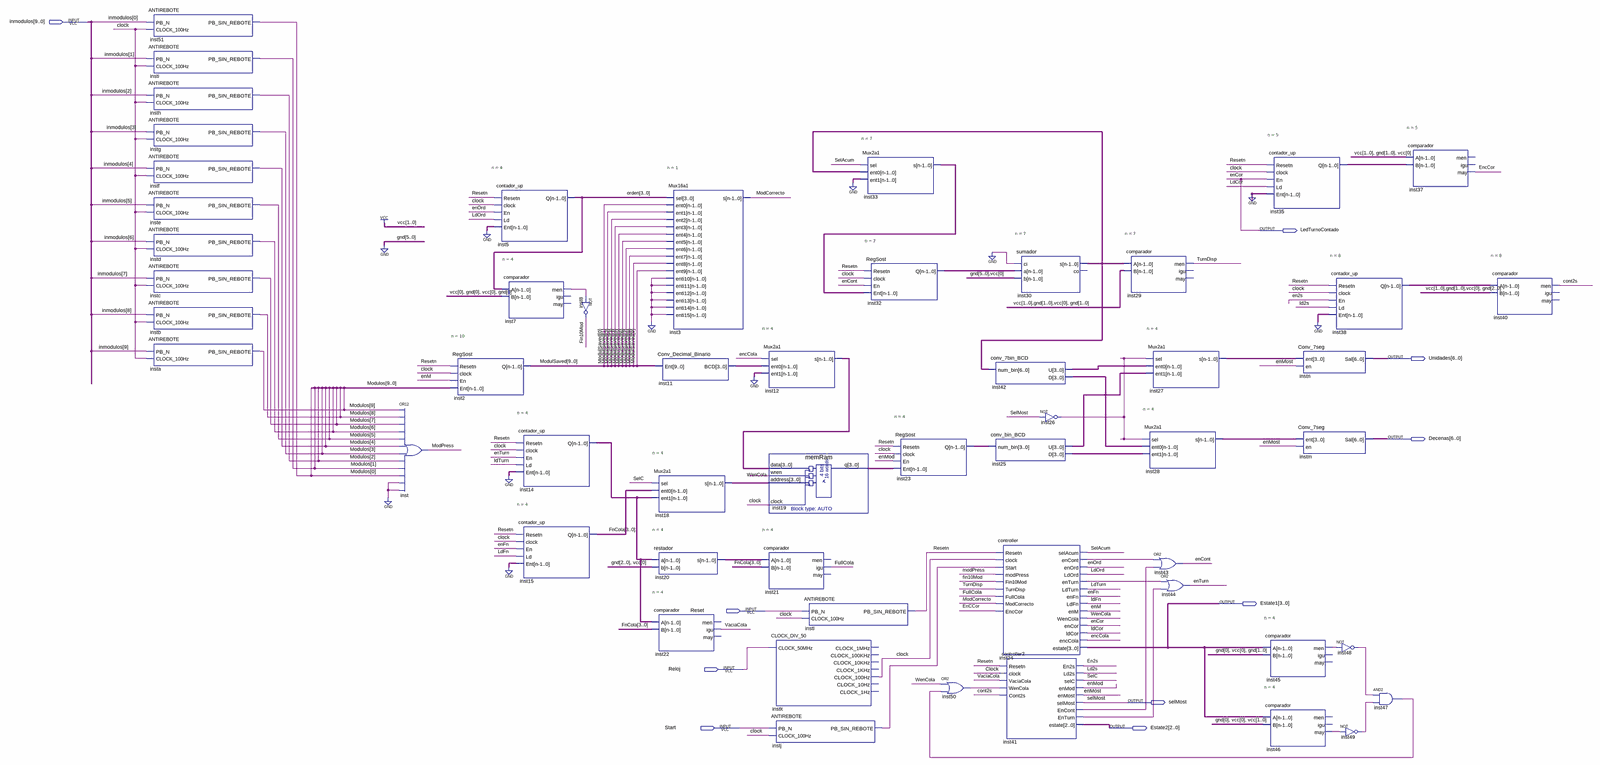
[diagram p0: schematic sheet, whole]
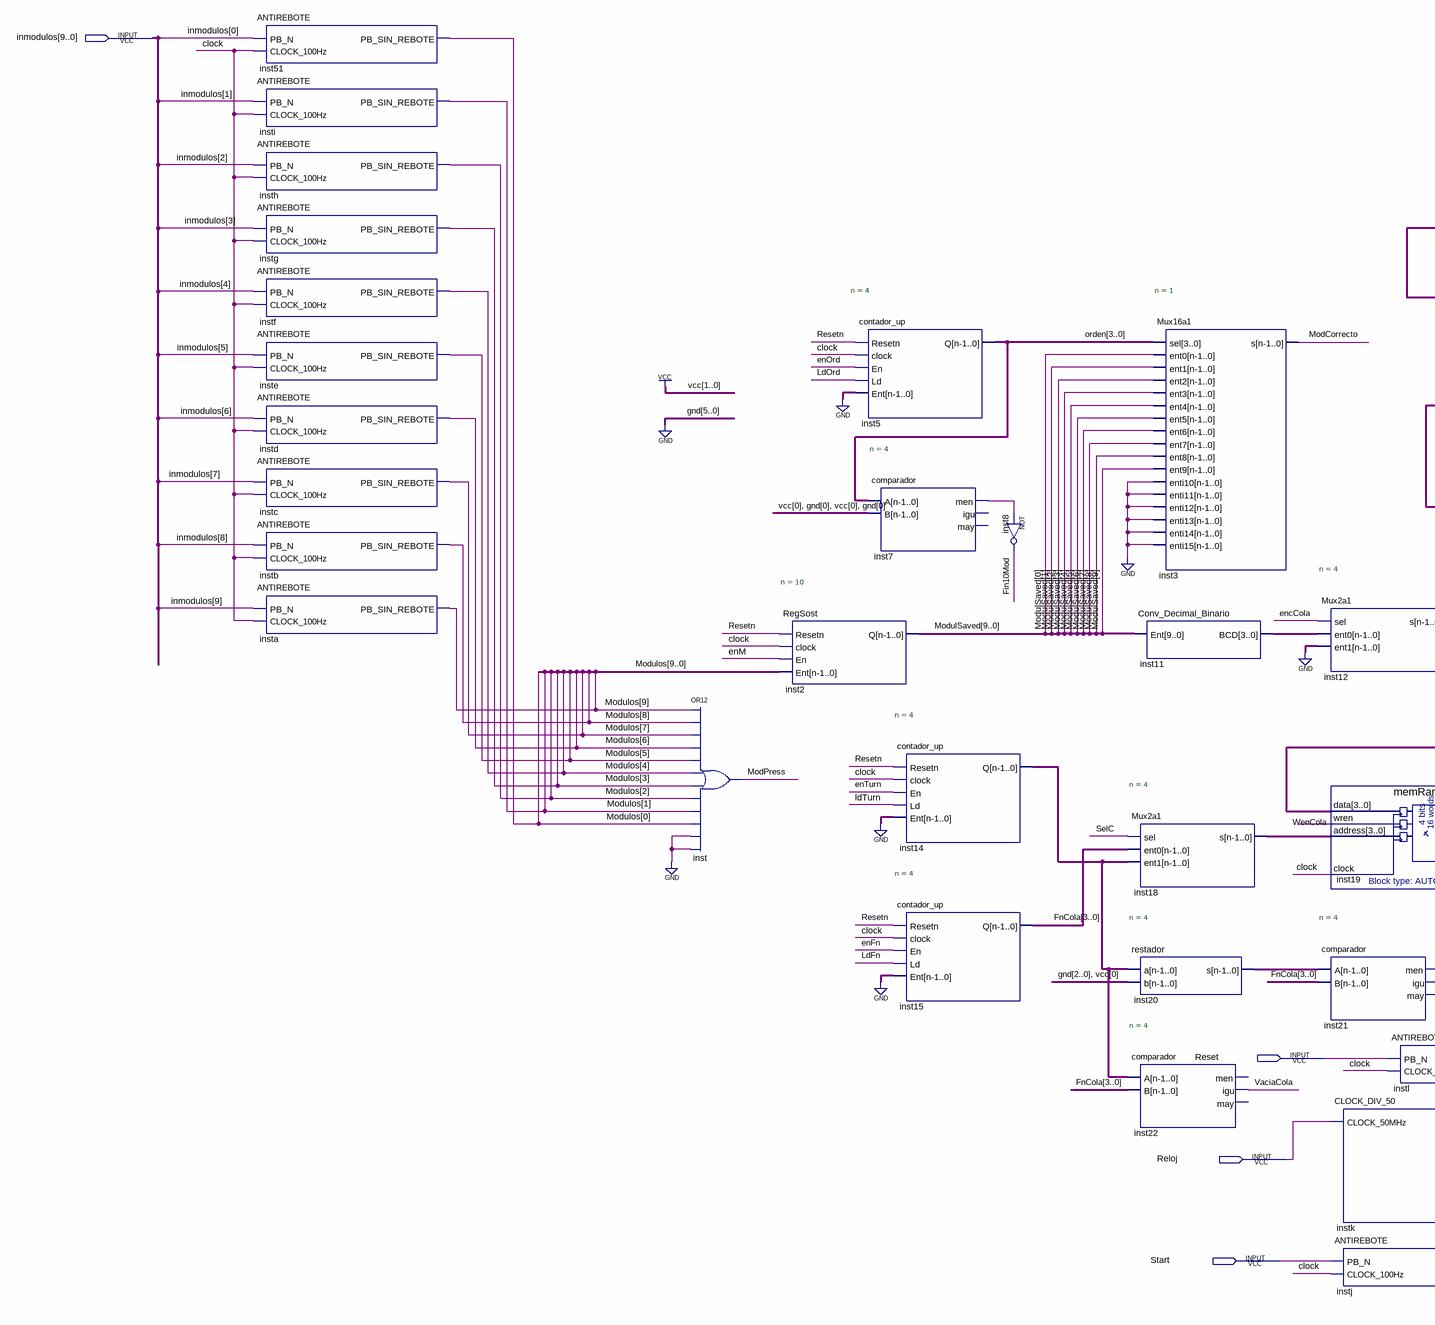
[diagram p1: schematic sheet, left part]
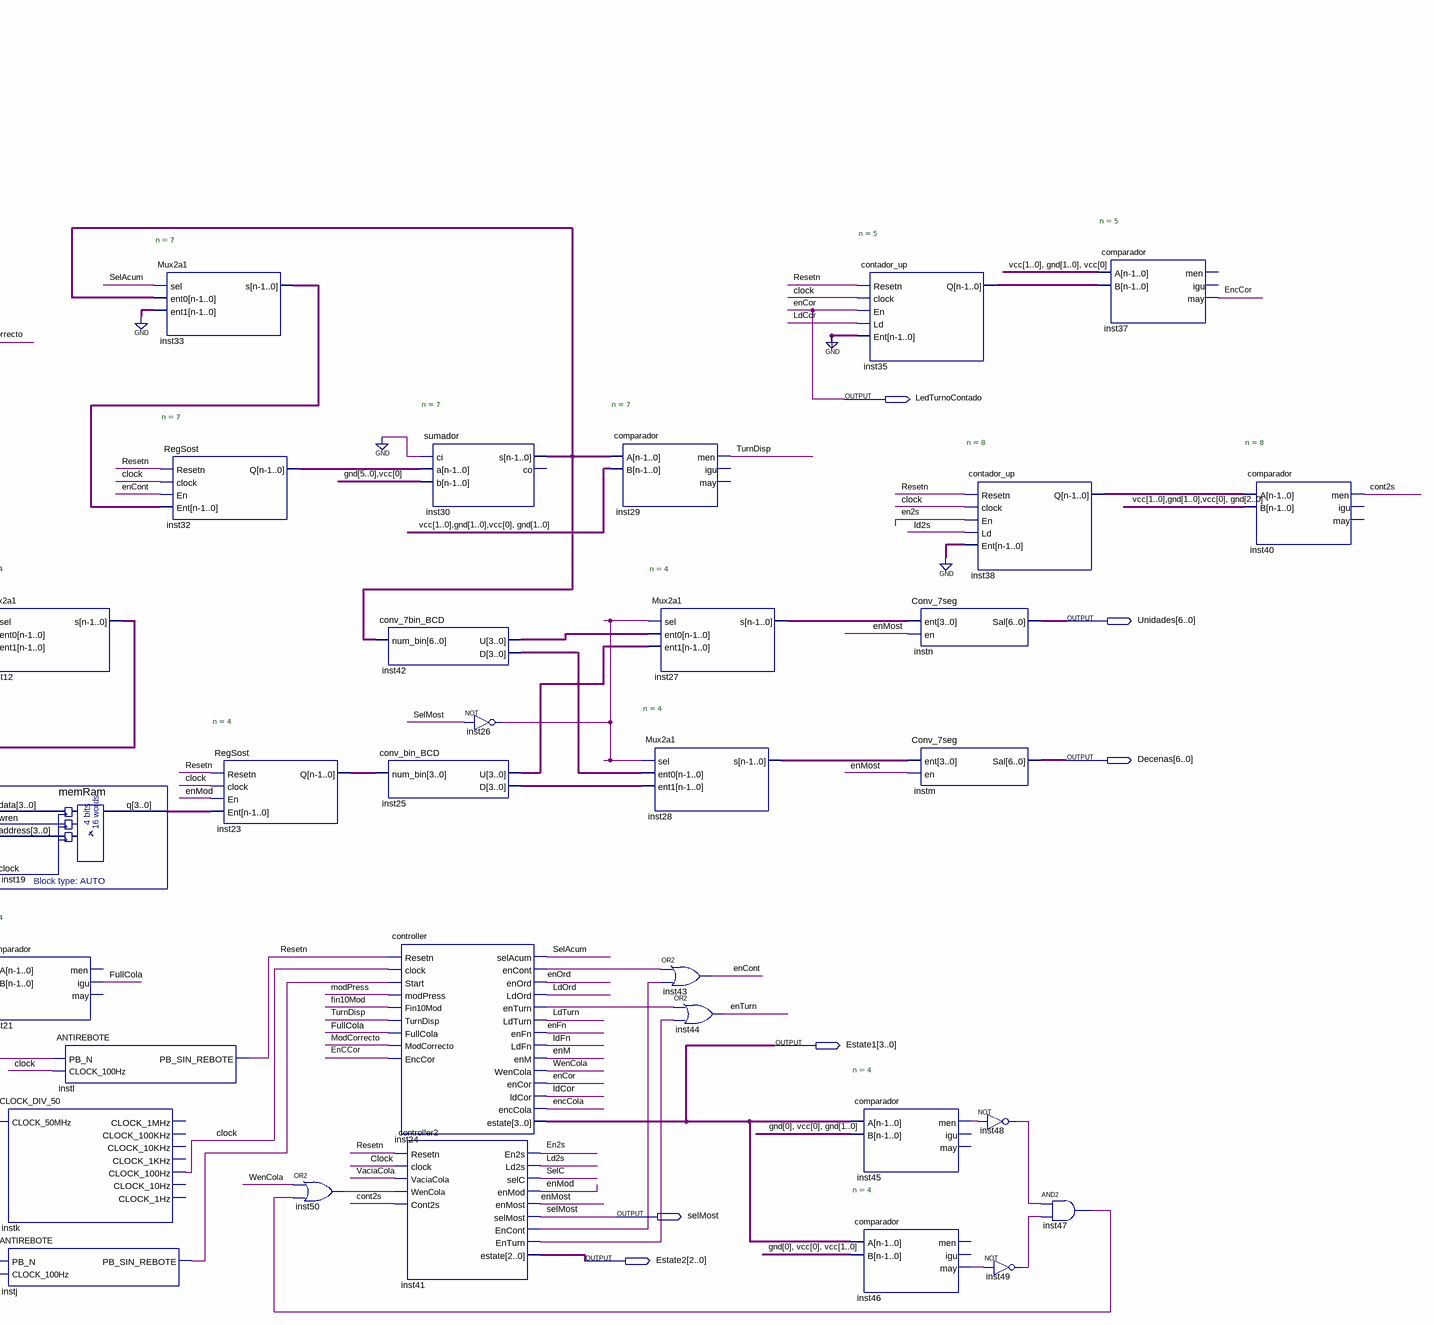
[diagram p2: schematic sheet, right part]
// Quartus schematic turno.bdf as structural Verilog: 54 symbols, 10 pins
module turno (
  input  [9:0] inmodulos,
  input  Reset,
  input  Reloj,
  input  Start,
  output LedTurnoContado,
  output [6:0] Unidades,
  output [6:0] Decenas,
  output [3:0] Estate1,
  output selMost,
  output [2:0] Estate2
);

  wire clock, cont2s, en2s, encCola, EncCor, enCont, enFn, enM, enMod, enMost, enOrd, enTurn, Fin10Mod,
       FullCola, inst7_men, inst24_encont, inst24_enturn, inst26_out, inst41_encont, inst41_enturn,
       inst45_men, inst46_may, inst47_out, inst48_out, inst49_out, inst50_out, instj_pb_sin_rebote, ld2s,
       LdCor, LdFn, LdOrd, ldTurn, ModCorrecto, ModPress, Resetn, SelAcum, SelC, TurnDisp, VaciaCola, WenCola;
  wire [3:0] FnCola, inst11_bcd, inst12_s, inst14_q, inst18_s, inst19_q, inst20_s, inst23_q, inst25_d,
       inst25_u, inst27_s, inst28_s, inst42_d, inst42_u, orden;
  wire [4:0] inst35_q;
  wire [6:0] inst30_s, inst32_q, inst33_s;
  wire [7:0] inst38_q;
  wire [9:0] Modulos, ModulSaved;

  ANTIREBOTE inst51 (.PB_N(inmodulos[0]), .CLOCK_100Hz(clock), .PB_SIN_REBOTE(Modulos[0]));
  ANTIREBOTE insti (.PB_N(inmodulos[1]), .CLOCK_100Hz(clock), .PB_SIN_REBOTE(Modulos[1]));
  ANTIREBOTE insth (.PB_N(inmodulos[2]), .CLOCK_100Hz(clock), .PB_SIN_REBOTE(Modulos[2]));
  ANTIREBOTE instg (.PB_N(inmodulos[3]), .CLOCK_100Hz(clock), .PB_SIN_REBOTE(Modulos[3]));
  ANTIREBOTE instf (.PB_N(inmodulos[4]), .CLOCK_100Hz(clock), .PB_SIN_REBOTE(Modulos[4]));
  ANTIREBOTE inste (.PB_N(inmodulos[5]), .CLOCK_100Hz(clock), .PB_SIN_REBOTE(Modulos[5]));
  ANTIREBOTE instd (.PB_N(inmodulos[6]), .CLOCK_100Hz(clock), .PB_SIN_REBOTE(Modulos[6]));
  ANTIREBOTE instc (.PB_N(inmodulos[7]), .CLOCK_100Hz(clock), .PB_SIN_REBOTE(Modulos[7]));
  ANTIREBOTE instb (.PB_N(inmodulos[8]), .CLOCK_100Hz(clock), .PB_SIN_REBOTE(Modulos[8]));
  ANTIREBOTE insta (.PB_N(inmodulos[9]), .CLOCK_100Hz(clock), .PB_SIN_REBOTE(Modulos[9]));
  or inst (ModPress, Modulos[9], Modulos[8], Modulos[7], Modulos[6], Modulos[5], Modulos[4], Modulos[3], Modulos[2], Modulos[1], Modulos[0], 1'b0, 1'b0);
  RegSost #(.n(10)) inst2 (.Resetn(Resetn), .clock(clock), .En(enM), .Ent(Modulos), .Q(ModulSaved));
  contador_up #(.n(4)) inst5 (.Resetn(Resetn), .clock(clock), .En(enOrd), .Ld(LdOrd), .Ent(4'b0000), .Q(orden));
  comparador #(.n(4)) inst7 (.A(orden), .B(4'b1010), .men(inst7_men));  // open: igu, may
  contador_up #(.n(4)) inst14 (.Resetn(Resetn), .clock(clock), .En(enTurn), .Ld(ldTurn), .Ent(4'b0000), .Q(inst14_q));
  contador_up #(.n(4)) inst15 (.Resetn(Resetn), .clock(clock), .En(enFn), .Ld(LdFn), .Ent(4'b0000), .Q(FnCola));
  not inst8 (Fin10Mod, inst7_men);
  Mux16a1 #(.n(1)) inst3 (
    .sel(orden), .ent0(ModulSaved[0]), .ent1(ModulSaved[1]), .ent2(ModulSaved[2]), .ent3(ModulSaved[3]),
    .ent4(ModulSaved[4]), .ent5(ModulSaved[5]), .ent6(ModulSaved[6]), .ent7(ModulSaved[7]),
    .ent8(ModulSaved[8]), .ent9(ModulSaved[9]), .enti10(1'b0), .enti11(1'b0), .enti12(1'b0), .enti13(1'b0),
    .enti14(1'b0), .enti15(1'b0), .s(ModCorrecto));
  Conv_Decimal_Binario inst11 (.Ent(ModulSaved), .BCD(inst11_bcd));
  Mux2a1 #(.n(4)) inst18 (.sel(SelC), .ent0(FnCola), .ent1(inst14_q), .s(inst18_s));
  restador #(.n(4)) inst20 (.a(inst14_q), .b(4'b0001), .s(inst20_s));
  comparador #(.n(4)) inst22 (.A(inst14_q), .B(FnCola), .igu(VaciaCola));  // open: men, may
  Mux2a1 #(.n(4)) inst12 (.sel(encCola), .ent0(inst11_bcd), .ent1(4'b0000), .s(inst12_s));
  comparador #(.n(4)) inst21 (.A(inst20_s), .B(FnCola), .igu(FullCola));  // open: men, may
  memRam inst19 (.data(inst12_s), .wren(WenCola), .address(inst18_s), .clock(clock), .q(inst19_q));
  CLOCK_DIV_50 instk (
    .CLOCK_50MHz(Reloj), .CLOCK_100Hz(clock));  // open: CLOCK_1MHz, CLOCK_100KHz, CLOCK_10KHz, CLOCK_1KHz, CLOCK_10Hz, CLOCK_1Hz
  ANTIREBOTE instj (.PB_N(Start), .CLOCK_100Hz(clock), .PB_SIN_REBOTE(instj_pb_sin_rebote));
  ANTIREBOTE instl (.PB_N(Reset), .CLOCK_100Hz(clock), .PB_SIN_REBOTE(Resetn));
  Mux2a1 #(.n(7)) inst33 (.sel(SelAcum), .ent0(inst30_s), .ent1({7{1'b0}}), .s(inst33_s));
  RegSost #(.n(7)) inst32 (.Resetn(Resetn), .clock(clock), .En(enCont), .Ent(inst33_s), .Q(inst32_q));
  RegSost #(.n(4)) inst23 (.Resetn(Resetn), .clock(clock), .En(enMod), .Ent(inst19_q), .Q(inst23_q));
  or inst50 (inst50_out, WenCola, inst47_out);
  conv_7bin_BCD inst42 (.num_bin(inst30_s), .U(inst42_u), .D(inst42_d));
  conv_bin_BCD inst25 (.num_bin(inst23_q), .U(inst25_u), .D(inst25_d));
  controller inst24 (
    .Resetn(Resetn), .clock(clock), .Start(instj_pb_sin_rebote), .modPress(ModPress), .Fin10Mod(Fin10Mod),
    .TurnDisp(TurnDisp), .FullCola(FullCola), .ModCorrecto(ModCorrecto), .EncCor(EncCor), .selAcum(SelAcum),
    .enCont(inst24_encont), .enOrd(enOrd), .LdOrd(LdOrd), .enTurn(inst24_enturn), .LdTurn(ldTurn),
    .enFn(enFn), .LdFn(LdFn), .enM(enM), .WenCola(WenCola), .enCor(LedTurnoContado), .ldCor(LdCor),
    .encCola(encCola), .estate(Estate1));
  sumador #(.n(7)) inst30 (.ci(1'b0), .a(inst32_q), .b(7'b0000001), .s(inst30_s));  // open: co
  controller2 inst41 (
    .Resetn(Resetn), .clock(clock), .VaciaCola(VaciaCola), .WenCola(inst50_out), .Cont2s(cont2s),
    .En2s(en2s), .Ld2s(ld2s), .selC(SelC), .enMod(enMod), .enMost(enMost), .selMost(selMost),
    .EnCont(inst41_encont), .EnTurn(inst41_enturn), .estate(Estate2));
  not inst26 (inst26_out, selMost);
  comparador #(.n(7)) inst29 (.A(inst30_s), .B(7'b1100100), .men(TurnDisp));  // open: igu, may
  Mux2a1 #(.n(4)) inst28 (.sel(inst26_out), .ent0(inst42_d), .ent1(inst25_d), .s(inst28_s));
  Mux2a1 #(.n(4)) inst27 (.sel(inst26_out), .ent0(inst42_u), .ent1(inst25_u), .s(inst27_s));
  or inst43 (enCont, inst24_encont, inst41_encont);
  or inst44 (enTurn, inst24_enturn, inst41_enturn);
  contador_up #(.n(5)) inst35 (
    .Resetn(Resetn), .clock(clock), .En(LedTurnoContado), .Ld(LdCor), .Ent({5{1'b0}}), .Q(inst35_q));
  comparador #(.n(4)) inst45 (.A(Estate1), .B(4'b0100), .men(inst45_men));  // open: igu, may
  comparador #(.n(4)) inst46 (.A(Estate1), .B(4'b0111), .may(inst46_may));  // open: men, igu
  Conv_7seg instn (.ent(inst27_s), .en(enMost), .Sal(Unidades));
  Conv_7seg instm (.ent(inst28_s), .en(enMost), .Sal(Decenas));
  contador_up #(.n(8)) inst38 (.Resetn(Resetn), .clock(clock), .En(en2s), .Ld(ld2s), .Ent({8{1'b0}}), .Q(inst38_q));
  not inst48 (inst48_out, inst45_men);
  not inst49 (inst49_out, inst46_may);
  and inst47 (inst47_out, inst48_out, inst49_out);
  comparador #(.n(5)) inst37 (.A(5'b11001), .B(inst35_q), .may(EncCor));  // open: men, igu
  comparador #(.n(8)) inst40 (.A(inst38_q), .B(8'b11001000), .men(cont2s));  // open: igu, may

  // Other names for the same wires on the sheet: enCor = LedTurnoContado
endmodule
